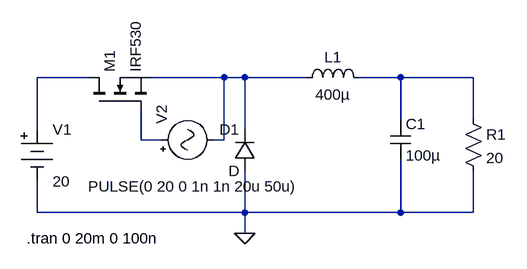
[diagram p0: schematic Buck_Converter.asc]
Buck_Converter.asc, the LTspice schematic file:
Version 4
SHEET 1 880 680
WIRE 0 64 -80 64
WIRE 208 64 96 64
WIRE 240 64 208 64
WIRE 336 64 240 64
WIRE 480 64 416 64
WIRE 592 64 480 64
WIRE 480 128 480 64
WIRE 592 128 592 64
WIRE -80 144 -80 64
WIRE 240 144 240 64
WIRE 80 160 80 112
WIRE 112 160 80 160
WIRE 208 160 208 64
WIRE 208 160 192 160
WIRE -80 272 -80 224
WIRE 240 272 240 208
WIRE 240 272 -80 272
WIRE 480 272 480 192
WIRE 480 272 240 272
WIRE 592 272 592 208
WIRE 592 272 480 272
WIRE 240 304 240 272
FLAG 240 304 0
SYMBOL diode 256 208 R180
WINDOW 0 24 64 Left 2
WINDOW 3 24 0 Left 2
SYMATTR InstName D1
SYMBOL ind 320 80 R270
WINDOW 0 32 56 VTop 2
WINDOW 3 5 56 VBottom 2
SYMATTR InstName L1
SYMATTR Value 400µ
SYMBOL cap 464 128 R0
SYMATTR InstName C1
SYMATTR Value 100µ
SYMBOL res 576 112 R0
SYMATTR InstName R1
SYMATTR Value 20
SYMBOL Misc\\battery -80 128 R0
WINDOW 123 0 0 Left 0
WINDOW 39 0 0 Left 0
SYMATTR InstName V1
SYMATTR Value 20
SYMBOL nmos 0 112 R270
SYMATTR InstName M1
SYMATTR Value IRF530
SYMBOL Misc\\signal 96 160 R270
WINDOW 3 -72 -97 VRight 2
WINDOW 123 0 0 Left 0
WINDOW 39 0 0 Left 0
SYMATTR Value PULSE(0 20 0 1n 1n 20u 50u)
SYMATTR InstName V2
TEXT -96 312 Left 2 !.tran 0 20m 0 100n

The netlist it stands for:
* Buck_Converter.asc
D1 0 N002 D
L1 N002 N003 400µ
C1 N003 0 100µ
R1 N003 0 20
V1 N001 0 20
M1 N001 N004 N002 N002 IRF530
V2 N004 N002 PULSE(0 20 0 1n 1n 20u 50u)
.model D D
.lib standard.dio
.model NMOS NMOS
.model PMOS PMOS
.lib standard.mos
.tran 0 20m 0 100n
.backanno
.end